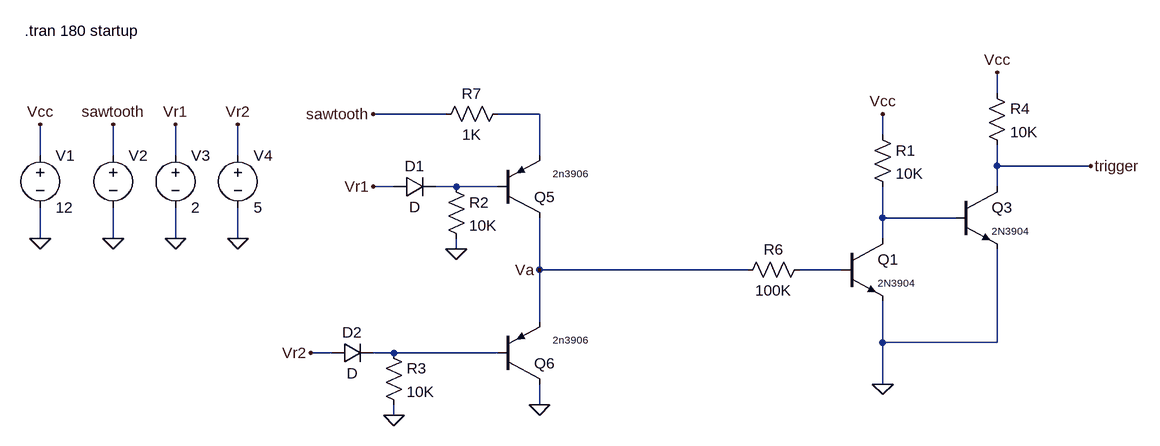
[diagram p0: schematic window-comparator2.asc]
window-comparator2.asc, the LTspice schematic file:
Version 4
SHEET 1 1076 980
WIRE -1008 96 -1008 64
WIRE -1856 128 -1968 128
WIRE -1712 128 -1776 128
WIRE -1184 160 -1184 128
WIRE -2480 192 -2480 144
WIRE -2368 192 -2368 144
WIRE -2272 192 -2272 144
WIRE -2176 192 -2176 144
WIRE -1712 192 -1712 128
WIRE -1008 208 -1008 176
WIRE -864 208 -1008 208
WIRE -1936 240 -1968 240
WIRE -1840 240 -1872 240
WIRE -1776 240 -1840 240
WIRE -1008 240 -1008 208
WIRE -1184 288 -1184 240
WIRE -1072 288 -1184 288
WIRE -2480 320 -2480 272
WIRE -2368 320 -2368 272
WIRE -2272 320 -2272 272
WIRE -2176 320 -2176 272
WIRE -1184 320 -1184 288
WIRE -1840 336 -1840 320
WIRE -1712 368 -1712 288
WIRE -1392 368 -1712 368
WIRE -1248 368 -1312 368
WIRE -1712 448 -1712 368
WIRE -1184 480 -1184 416
WIRE -1008 480 -1008 336
WIRE -1008 480 -1184 480
WIRE -2032 496 -2064 496
WIRE -1936 496 -1968 496
WIRE -1776 496 -1936 496
WIRE -1184 544 -1184 480
WIRE -1712 576 -1712 544
WIRE -1936 592 -1936 576
FLAG -2480 320 0
FLAG -2480 144 Vcc
FLAG -2368 320 0
FLAG -2368 144 sawtooth
FLAG -2272 320 0
FLAG -2272 144 Vr1
FLAG -2176 320 0
FLAG -2176 144 Vr2
FLAG -1968 128 sawtooth
FLAG -1968 240 Vr1
FLAG -1184 128 Vcc
FLAG -1840 336 0
FLAG -1936 592 0
FLAG -2064 496 Vr2
FLAG -864 208 trigger
FLAG -1008 64 Vcc
FLAG -1184 544 0
FLAG -1712 368 Va
FLAG -1712 576 0
SYMBOL voltage -2480 176 R0
WINDOW 123 0 0 Left 0
WINDOW 39 0 0 Left 0
SYMATTR InstName V1
SYMATTR Value 12
SYMBOL voltage -2368 176 R0
WINDOW 123 0 0 Left 0
WINDOW 39 0 0 Left 0
WINDOW 3 24 96 Invisible 2
SYMATTR Value PULSE(0 7.4 0 60s 0 0 60s)
SYMATTR InstName V2
SYMBOL voltage -2272 176 R0
WINDOW 123 0 0 Left 0
WINDOW 39 0 0 Left 0
SYMATTR InstName V3
SYMATTR Value 2
SYMBOL voltage -2176 176 R0
WINDOW 123 0 0 Left 0
WINDOW 39 0 0 Left 0
SYMATTR InstName V4
SYMATTR Value 5
SYMBOL pnp -1776 288 M180
WINDOW 3 84 68 Left 1
SYMATTR Value 2n3906
SYMATTR InstName Q5
SYMBOL pnp -1776 544 M180
WINDOW 3 84 68 Left 1
SYMATTR Value 2n3906
SYMATTR InstName Q6
SYMBOL npn -1248 320 R0
WINDOW 3 56 68 Left 1
SYMATTR Value 2N3904
SYMATTR InstName Q1
SYMBOL res -1200 144 R0
SYMATTR InstName R1
SYMATTR Value 10K
SYMBOL diode -1936 256 R270
WINDOW 0 32 32 VTop 2
WINDOW 3 0 32 VBottom 2
SYMATTR InstName D1
SYMBOL diode -2032 512 R270
WINDOW 0 32 32 VTop 2
WINDOW 3 0 32 VBottom 2
SYMATTR InstName D2
SYMBOL res -1856 224 R0
SYMATTR InstName R2
SYMATTR Value 10K
SYMBOL res -1952 480 R0
SYMATTR InstName R3
SYMATTR Value 10K
SYMBOL npn -1072 240 R0
WINDOW 3 56 68 Left 1
SYMATTR Value 2N3904
SYMATTR InstName Q3
SYMBOL res -1024 80 R0
SYMATTR InstName R4
SYMATTR Value 10K
SYMBOL res -1296 352 R90
WINDOW 0 0 56 VBottom 2
WINDOW 3 32 56 VTop 2
SYMATTR InstName R6
SYMATTR Value 100K
SYMBOL res -1760 112 R90
WINDOW 0 0 56 VBottom 2
WINDOW 3 32 56 VTop 2
SYMATTR InstName R7
SYMATTR Value 1K
TEXT -2504 0 Left 2 !.tran 180 startup

The netlist it stands for:
* window-comparator2.asc
V1 Vcc 0 12
V2 sawtooth 0 PULSE(0 7.4 0 60s 0 0 60s)
V3 Vr1 0 2
V4 Vr2 0 5
Q5 Va N002 N001 0 2n3906
Q6 0 N005 Va 0 2n3906
Q1 N003 N004 0 0 2N3904
R1 Vcc N003 10K
D1 Vr1 N002 D
D2 Vr2 N005 D
R2 N002 0 10K
R3 N005 0 10K
Q3 trigger N003 0 0 2N3904
R4 Vcc trigger 10K
R6 N004 Va 100K
R7 N001 sawtooth 1K
.model D D
.lib standard.dio
.model NPN NPN
.model PNP PNP
.lib standard.bjt
.tran 180 startup
.backanno
.end